# Altium schematic sheet Measurements_AC.SchDoc
size A4
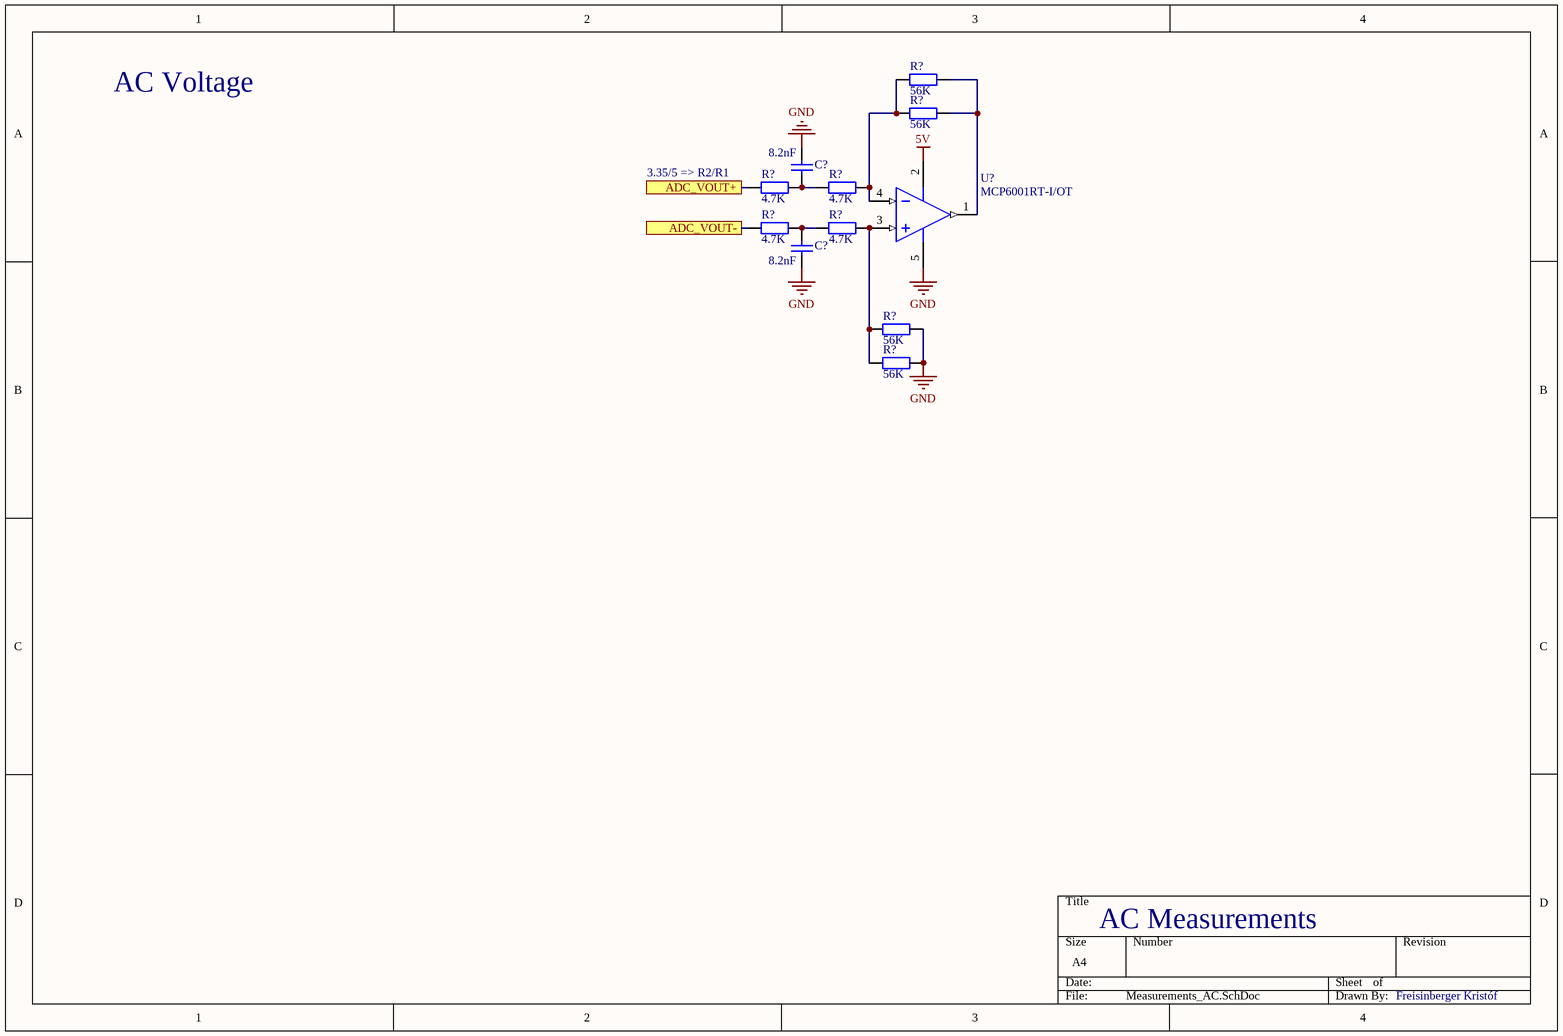
[diagram p0: Measurements_AC.SchDoc]

## Parts
(Parts that share a designator on the sheet are numbered #1, #2 ... from top to bottom, then left to right.)
C?#1  8.2nF  [FP_0805_CAP_085]
C?#2  8.2nF  [FP_0805_CAP_085]
R?#1  56K  [FP_0603_RES]
R?#2  56K  [FP_0603_RES]
R?#3  4.7K  [FP_0603_RES]
R?#4  4.7K  [FP_0603_RES]
R?#5  4.7K  [FP_0603_RES]
R?#6  4.7K  [FP_0603_RES]
R?#7  56K  [FP_0603_RES]
R?#8  56K  [FP_0603_RES]
U?  MCP6001RT-I/OT  [SOT-23-OT5_M]

## Ports
ADC_VOUT+, ADC_VOUT-

## Nets
5V: U?.2(VDD)
GND: C?#1.2 C?#2.1 R?#7.2 R?#8.2 U?.5(VSS)
ADC_VOUT+: R?#3.1 ; port ADC_VOUT+
ADC_VOUT-: R?#5.1 ; port ADC_VOUT-
NetC?#1_1: C?#1.1 R?#3.2 R?#4.1
NetC?#2_2: C?#2.2 R?#5.2 R?#6.1
NetR?#1_1: R?#1.1 R?#2.1 R?#4.2 U?.4(VIN-)
NetR?#1_2: R?#1.2 R?#2.2 U?.1(VOUT)
NetR?#6_2: R?#6.2 R?#7.1 R?#8.1 U?.3(VIN+)

## Notes on the sheet
- AC Voltage
- (near R?#3) 3.35/5 => R2/R1
- AC Measurements
- Freisinberger Kristóf

## Library data of the parts
C?#1 C?#2 = CAP: Capacitor; Value: 8.2nF
R?#1-R?#8 = RES: Resistor
  R?#1 R?#2 R?#7 R?#8: Value: 56K
  R?#3-R?#6: Value: 4.7K
U? = CMP-0187-00469-2: 1 MHz, Low-Power Operational Amplifier, 5-Pin SOT-23, Industrial Temperature, Tape and Reel; ComponentLink1URL: http://www.microchip.com/; DatasheetVersion: revJ, Nov-2009; PackageVersion: revBB, Aug-2009; RevisionNote: URLs added.; ComponentLink1Description: Manufacturer URL; PackageReference: SOT-23-OT5; ComponentLink3Description: Package Specification; ComponentLink2Description: Datasheet; ComponentLink2URL: http://ww1.microchip.com/downloads/en/DeviceDoc/21733j.pdf; ComponentLink3URL: http://www.microchip.com/stellent/groups/techpub_sg/documents/packagingspec/en012702.pdf; PackageDescription: 5-Lead Plastic Small Outline Transistor (OT) [SOT-23]; Code_IPC: SOT23-5